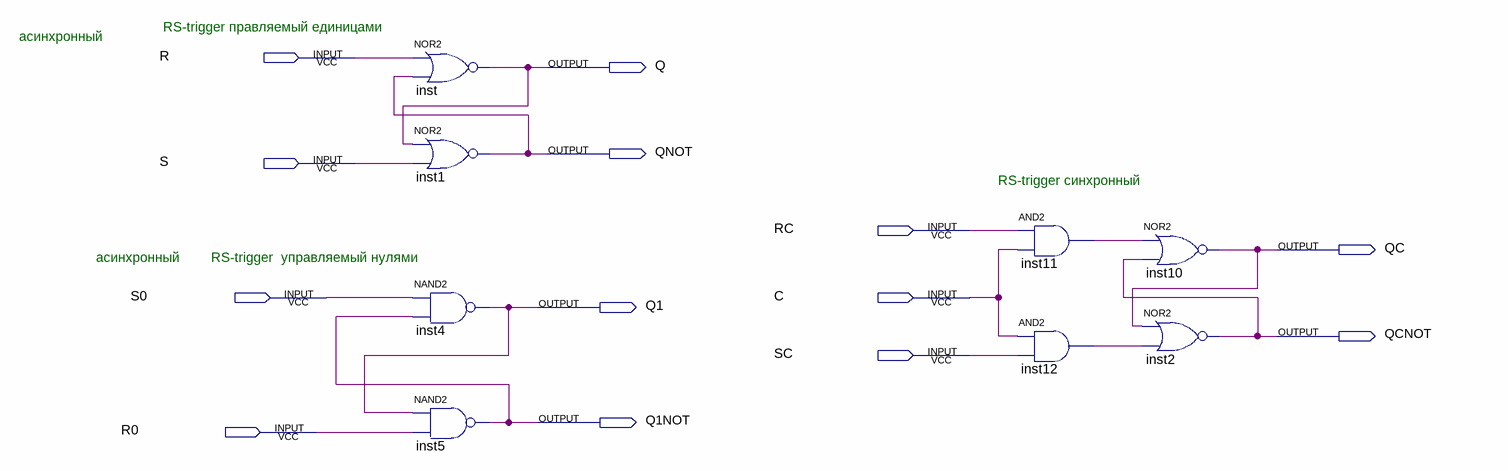
[diagram p0: schematic sheet]
// Quartus schematic RS-trigger.bdf as structural Verilog: 8 symbols, 13 pins
module \RS-trigger  (
  input  R,
  input  S,
  input  RC,
  input  S0,
  input  C,
  input  SC,
  input  R0,
  output Q,
  output QNOT,
  output QC,
  output Q1,
  output QCNOT,
  output Q1NOT
);

  wire inst11_out, inst12_out;

  nor inst (Q, R, QNOT);
  nor inst1 (QNOT, Q, S);
  nand inst4 (Q1, S0, Q1NOT);
  nand inst5 (Q1NOT, Q1, R0);
  and inst11 (inst11_out, RC, C);
  and inst12 (inst12_out, C, SC);
  nor inst10 (QC, inst11_out, QCNOT);
  nor inst2 (QCNOT, QC, inst12_out);

  // Notes on the sheet:
  //   RS-trigger правляемый единицами
  //   асинхронный
  //   RS-trigger синхронный
  //   асинхронный
  //   RS-trigger  управляемый нулями
endmodule
